# Altium schematic sheet 64 Electrode Wafer.SchDoc
size E; SheetNumber: 1; SheetTotal: 1
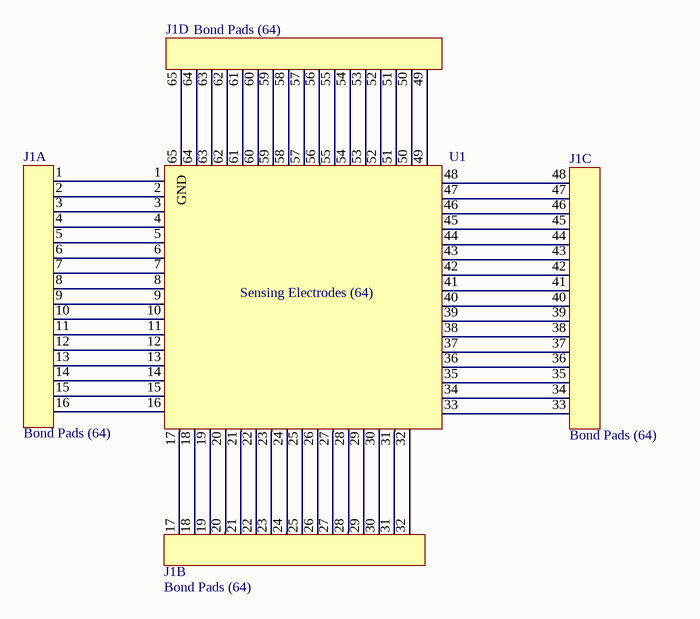
[diagram p0: 64 Electrode Wafer.SchDoc]

## Parts
J1  Bond Pads (64)  [Bond Pads (64)]  (parts A,B,C,D of 4)
U1  Sensing Electrodes (64)  [Sensing Area (64)]

## Nets
NetJ1_1: J1.1 U1.1
NetJ1_2: J1.2 U1.2
NetJ1_3: J1.3 U1.3
NetJ1_4: J1.4 U1.4
NetJ1_5: J1.5 U1.5
NetJ1_6: J1.6 U1.6
NetJ1_7: J1.7 U1.7
NetJ1_8: J1.8 U1.8
NetJ1_9: J1.9 U1.9
NetJ1_10: J1.10 U1.10
NetJ1_11: J1.11 U1.11
NetJ1_12: J1.12 U1.12
NetJ1_13: J1.13 U1.13
NetJ1_14: J1.14 U1.14
NetJ1_15: J1.15 U1.15
NetJ1_16: J1.16 U1.16
NetJ1_17: J1.17 U1.17
NetJ1_18: J1.18 U1.18
NetJ1_19: J1.19 U1.19
NetJ1_20: J1.20 U1.20
NetJ1_21: J1.21 U1.21
NetJ1_22: J1.22 U1.22
NetJ1_23: J1.23 U1.23
NetJ1_24: J1.24 U1.24
NetJ1_25: J1.25 U1.25
NetJ1_26: J1.26 U1.26
NetJ1_27: J1.27 U1.27
NetJ1_28: J1.28 U1.28
NetJ1_29: J1.29 U1.29
NetJ1_30: J1.30 U1.30
NetJ1_31: J1.31 U1.31
NetJ1_32: J1.32 U1.32
NetJ1_33: J1.33 U1.33
NetJ1_34: J1.34 U1.34
NetJ1_35: J1.35 U1.35
NetJ1_36: J1.36 U1.36
NetJ1_37: J1.37 U1.37
NetJ1_38: J1.38 U1.38
NetJ1_39: J1.39 U1.39
NetJ1_40: J1.40 U1.40
NetJ1_41: J1.41 U1.41
NetJ1_42: J1.42 U1.42
NetJ1_43: J1.43 U1.43
NetJ1_44: J1.44 U1.44
NetJ1_45: J1.45 U1.45
NetJ1_46: J1.46 U1.46
NetJ1_47: J1.47 U1.47
NetJ1_48: J1.48 U1.48
NetJ1_49: J1.49 U1.49
NetJ1_50: J1.50 U1.50
NetJ1_51: J1.51 U1.51
NetJ1_52: J1.52 U1.52
NetJ1_53: J1.53 U1.53
NetJ1_54: J1.54 U1.54
NetJ1_55: J1.55 U1.55
NetJ1_56: J1.56 U1.56
NetJ1_57: J1.57 U1.57
NetJ1_58: J1.58 U1.58
NetJ1_59: J1.59 U1.59
NetJ1_60: J1.60 U1.60
NetJ1_61: J1.61 U1.61
NetJ1_62: J1.62 U1.62
NetJ1_63: J1.63 U1.63
NetJ1_64: J1.64 U1.64
NetJ1_65: J1.65 U1.65(GND)

## Library data of the parts
J1 = Bond Pads (64): 64 bond pads for 64 channel wafer; Part Number: Bond Pads (64)
U1 = 64 Electrode Sensing Area: 64 Electrodes covering a 2 mm by 2 mm sensing area; Part Number: 64 Electrode Sensing Area